# EAGLE design led_breakout (EAGLE 6.5.0)
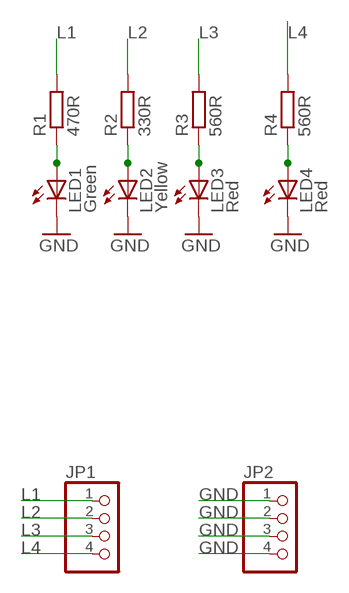
[diagram p0: schematic, sheet 1]

## Parts
JP1  PINHD-1X4  [1X04]
JP2  PINHD-1X4  [1X04]
LED1  Green  LEDCHIPLED_1206  [CHIPLED_1206]
LED2  Yellow  LEDCHIPLED_1206  [CHIPLED_1206]
LED3  Red  LEDCHIPLED_1206  [CHIPLED_1206]
LED4  Red  LEDCHIPLED_1206  [CHIPLED_1206]
R1  470R  R-EU_R0805  [R0805]
R2  330R  R-EU_R0805  [R0805]
R3  560R  R-EU_R0805  [R0805]
R4  560R  R-EU_R0805  [R0805]

## Nets
GND [GND]: JP2.1 JP2.2 JP2.3 JP2.4 LED1.C LED2.C LED3.C LED4.C
L1: JP1.1 R1.2
L2: JP1.2 R2.2
L3: JP1.3 R3.2
L4: JP1.4 R4.2
N$1: LED3.A R3.1
N$3: LED4.A R4.1
N$4: LED1.A R1.1
N$5: LED2.A R2.1

## Library data of the parts
JP1 JP2 = pinhead:PINHD-1X4: PIN HEADER
LED1-LED4 = adafruit:LED: LED OSRAM: - CHIPLED LG R971, LG N971, LY N971, LG Q971, LY Q971, LO R971, LY R971 LH N974, LH R974 LS Q976, LO Q976, LY Q976 LO Q996 - Hyper CHIPLED LW Q18S LB Q993, LB Q99A, LB R99A - SideLED LS A670, LO A670, LY A670, LG A670, LP A670 LB A673, LV A673, LT A673, LW A673 LH A674 LY A675 LS A676, LA A676, LO A676, LY A676, LW A676 LS A679, LY A679, LG A679 - Hyper Micro SIDELED® LS Y876, LA Y876, LO Y876, LY Y876 LT Y87S - SmartLED LW L88C, LW L88S LB L89C, LB L89S, LG L890 LS L89K, LO L89K, LY L89K LS L896, LA L896, LO L896, LY L896 - TOPLED LS T670, LO T670, LY T670, LG T670, LP T670 LSG T670, LSP T670, LSY T670, LOP T670, LYG T670 LG T671, LOG T671, LSG T671 LB T673, LV T673, LT T673, LW T673 LH T674 LS T676, LA T676, LO T676, LY T676, LB T676, LH T676, LSB T676, LW T676 LB T67C, LV T67C, LT T67C, LS T67K, LO T67K, LY T67K, LW E67C LS E67B, LA E67B, LO E67B, LY E67B, LB E67C, LV E67C, LT E67C LW T67C LS T679, LY T679, LG T679 LS T770, LO T770, LY T770, LG T770, LP T770 LB T773, LV T773, LT T773, LW T773 LH T774 LS E675, LA E675, LY E675, LS T675 LS T776, LA T776, LO T776, LY T776, LB T776 LHGB T686 LT T68C, LB T68C - Hyper Mini TOPLED® LB M676 - Mini TOPLED Santana® LG M470 LS M47K, LO M47K, LY M47K Source: http://www.osram.convergy.de/
R1-R4 = resistor:R-EU_: RESISTOR, European symbol

## Net classes
0 default: width 0.305 mm, drill 0.508 mm
1 GND: width 0.61 mm, drill 0.508 mm
2 VCC: width 0.61 mm, drill 0.508 mm

## Board
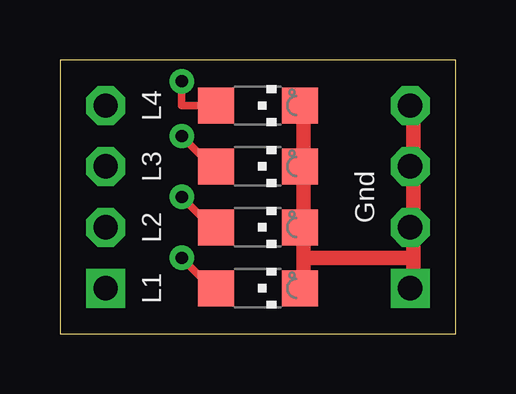
[diagram p1: board, top side]
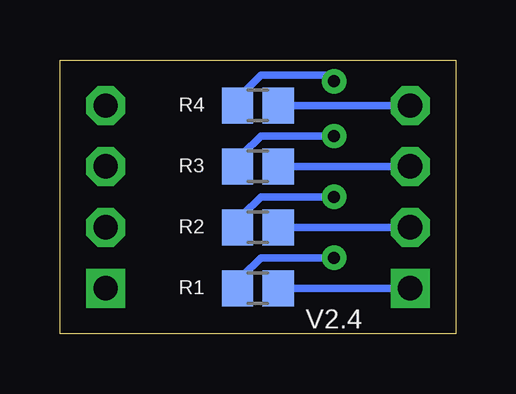
[diagram p2: board, bottom side, seen from below]

Size 16.51 x 11.43 mm. Coordinates in mm from the lower left corner, seen from the top.
Outline: 0,0 16.51,0 16.51,11.43 0,11.43 0,0
Copper layers (1*16): Top 0.035mm / dielectric 1.5mm / Bottom 0.035mm
Design rules "SparkFun *": minimum track width 12mil, minimum drill 20mil, track to track 8mil, track to pad 8mil, pad to pad 8mil, via to via 8mil, smd to smd 8mil, copper to edge 10mil, drill to drill 8mil, minimum pad ring 12mil, minimum via ring 10mil, stop-mask expansion 4mil, vias tented up to drill 25mil, thermal gap 10mil

### Footprints (pad centres in the part's own frame; a part is rotated, then mirrored left to right if it is on the bottom)
1X04 = drill 1.016 square: 1 -3.81,0 | drill 1.016 octagon: 2 -1.27,0; 3 1.27,0; 4 3.81,0
CHIPLED_1206 = smd 1.5 x 1.5: A 0,-1.75; C 0,1.75
R0805 = smd 1.3 x 1.5: 1 -0.85,0; 2 0.85,0

### Placement (x,y rotation side)
JP1  1.9,5.71 90 top
JP2  14.6,5.71 90 top
LED1  8.26,1.91 270 top
LED2  8.26,4.44 270 top
LED3  8.26,6.99 270 top
LED4  8.26,9.53 270 top
R1  8.26,1.91 0 bottom
R2  8.26,4.44 0 bottom
R3  8.26,6.99 0 bottom
R4  8.26,9.53 0 bottom

### Tracks (layer width: path | path; a pad name or v marks a point on that pad's centre or on a via)
GND
  Top 0.61: 10.16,3.17 10.16,4.44 LED2.C 10.16,4.7 10.16,6.99 LED3.C 10.16,7.24 10.16,9.53 LED4.C | 10.16,3.17 10.16,1.91 LED1.C | 14.73,3.17 14.73,4.44 JP2.2 14.73,4.7 14.73,6.99 JP2.3 14.73,7.24 14.73,9.53 JP2.4 | 14.73,3.17 14.73,1.91 JP2.1 | 14.73,3.17 10.16,3.17
L1
  Bottom 0.305: JP1.1 R1.2
L2
  Bottom 0.305: JP1.2 R2.2
L3
  Bottom 0.305: JP1.3 R3.2
L4
  Bottom 0.305: JP1.4 R4.2
N$1  (via drill 0.51)
  Top 0.305: v5.08,8.25 6.35,6.99 LED3.A
  Bottom 0.305: v5.08,8.25 8.13,8.25 8.89,7.49 8.89,6.99 R3.1
N$3  (via drill 0.51)
  Top 0.305: LED4.A 5.08,9.53 v5.08,10.54
  Bottom 0.305: v5.08,10.54 5.33,10.8 8.13,10.8 8.89,10.03 8.89,9.53 R4.1
N$4  (via drill 0.51)
  Top 0.305: v5.08,3.17 6.35,1.91 LED1.A
  Bottom 0.305: v5.08,3.17 8.13,3.17 8.89,2.41 8.89,1.91 R1.1
N$5  (via drill 0.51)
  Top 0.305: v5.08,5.71 6.35,4.44 LED2.A
  Bottom 0.305: v5.08,5.71 8.13,5.71 8.89,4.95 8.89,4.44 R2.1

### Text on the board
tNames: L4 | L3 | Gnd | L2 | L1
bNames: V2.4